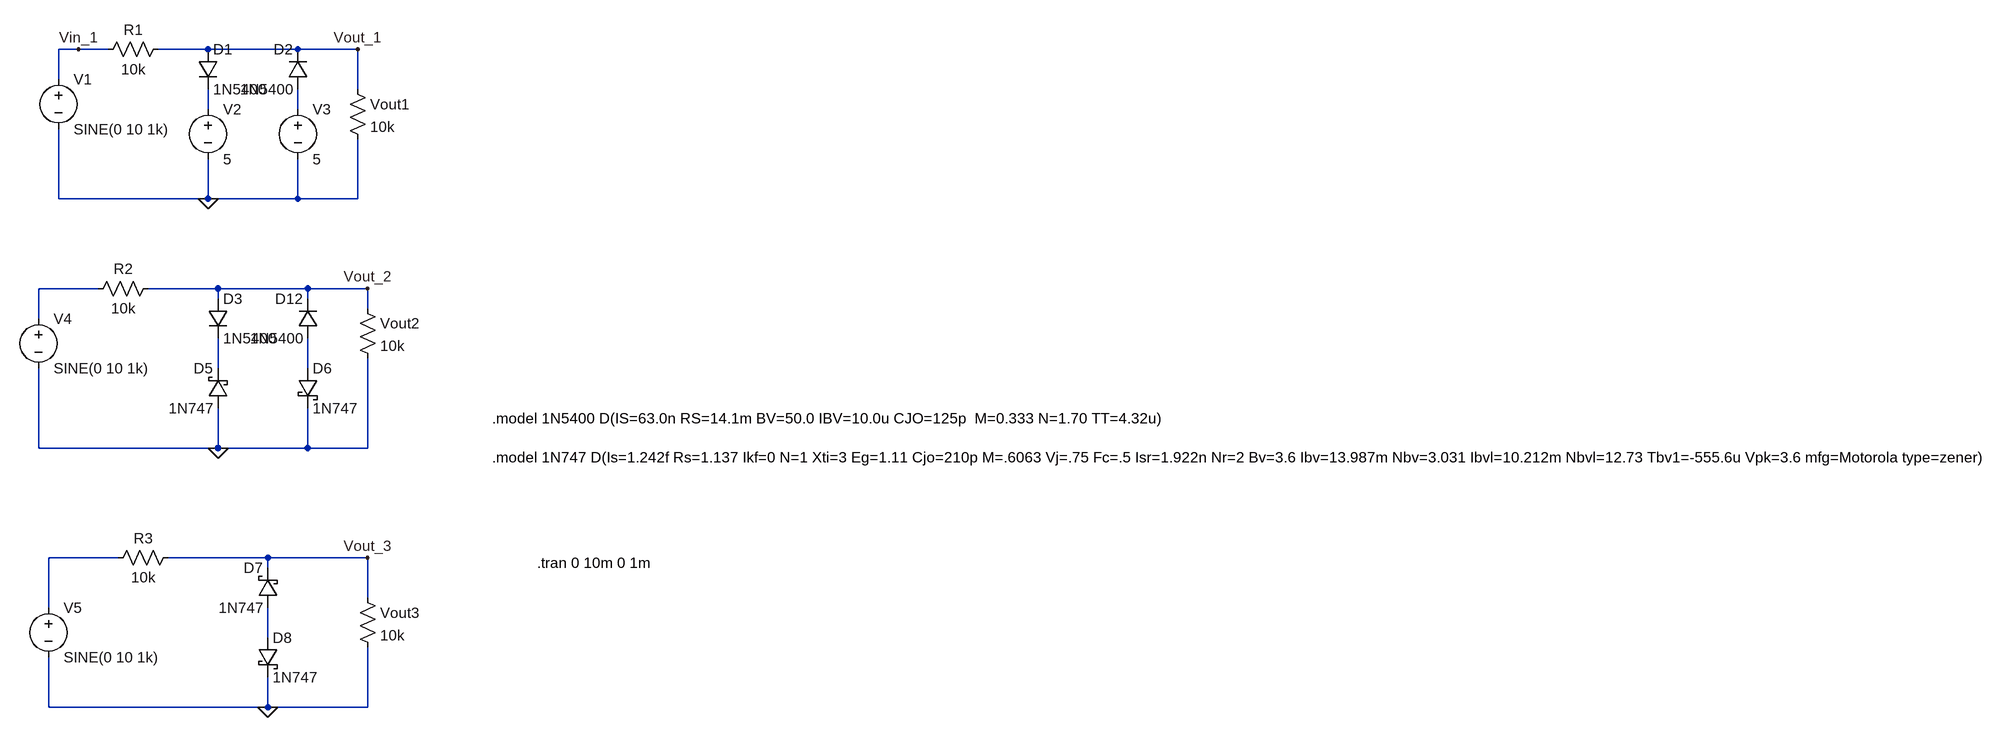
[diagram p0: schematic Lab3_2.asc]
Lab3_2.asc, the LTspice schematic file:
Version 4
SHEET 1 3268 1156
WIRE -48 80 -80 80
WIRE 0 80 -48 80
WIRE 160 80 80 80
WIRE 304 80 160 80
WIRE 400 80 304 80
WIRE -80 128 -80 80
WIRE 400 144 400 80
WIRE 160 176 160 144
WIRE 304 176 304 144
WIRE -80 320 -80 208
WIRE 160 320 160 256
WIRE 160 320 -80 320
WIRE 304 320 304 256
WIRE 304 320 160 320
WIRE 400 320 400 224
WIRE 400 320 304 320
WIRE -16 464 -112 464
WIRE 176 464 64 464
WIRE 320 464 176 464
WIRE 416 464 320 464
WIRE 176 480 176 464
WIRE 320 480 320 464
WIRE 416 496 416 464
WIRE -112 512 -112 464
WIRE 176 592 176 544
WIRE 320 592 320 544
WIRE -112 720 -112 592
WIRE 176 720 176 656
WIRE 176 720 -112 720
WIRE 320 720 320 656
WIRE 320 720 176 720
WIRE 416 720 416 576
WIRE 416 720 320 720
WIRE 16 896 -96 896
WIRE 256 896 96 896
WIRE 416 896 256 896
WIRE 256 912 256 896
WIRE 416 960 416 896
WIRE -96 976 -96 896
WIRE 256 1024 256 976
WIRE -96 1136 -96 1056
WIRE 256 1136 256 1088
WIRE 256 1136 -96 1136
WIRE 416 1136 416 1040
WIRE 416 1136 256 1136
FLAG 160 320 0
FLAG 176 720 0
FLAG 256 1136 0
FLAG -48 80 Vin_1
FLAG 400 80 Vout_1
FLAG 416 464 Vout_2
FLAG 416 896 Vout_3
SYMBOL voltage -80 112 R0
WINDOW 123 0 0 Left 0
WINDOW 39 0 0 Left 0
SYMATTR InstName V1
SYMATTR Value SINE(0 10 1k)
SYMBOL res 96 64 R90
WINDOW 0 0 56 VBottom 2
WINDOW 3 32 56 VTop 2
SYMATTR InstName R1
SYMATTR Value 10k
SYMBOL diode 144 80 R0
SYMATTR InstName D1
SYMATTR Value 1N5400
SYMBOL voltage 160 160 R0
WINDOW 123 0 0 Left 0
WINDOW 39 0 0 Left 0
SYMATTR InstName V2
SYMATTR Value 5
SYMBOL voltage 304 160 R0
WINDOW 123 0 0 Left 0
WINDOW 39 0 0 Left 0
SYMATTR InstName V3
SYMATTR Value 5
SYMBOL diode 320 144 R180
WINDOW 0 24 64 Left 2
WINDOW 3 24 0 Left 2
SYMATTR InstName D2
SYMATTR Value 1N5400
SYMBOL res 384 128 R0
SYMATTR InstName Vout1
SYMATTR Value 10k
SYMBOL res -32 480 R270
WINDOW 0 32 56 VTop 2
WINDOW 3 0 56 VBottom 2
SYMATTR InstName R2
SYMATTR Value 10k
SYMBOL diode 160 480 R0
SYMATTR InstName D3
SYMATTR Value 1N5400
SYMBOL diode 336 544 R180
WINDOW 0 24 64 Left 2
WINDOW 3 24 0 Left 2
SYMATTR InstName D12
SYMATTR Value 1N5400
SYMBOL res 400 480 R0
SYMATTR InstName Vout2
SYMATTR Value 10k
SYMBOL voltage -112 496 R0
WINDOW 123 0 0 Left 0
WINDOW 39 0 0 Left 0
SYMATTR InstName V4
SYMATTR Value SINE(0 10 1k)
SYMBOL schottky 192 656 R180
WINDOW 0 24 64 Left 2
WINDOW 3 24 0 Left 2
SYMATTR InstName D5
SYMATTR Value 1N747
SYMATTR Description Diode
SYMATTR Type diode
SYMBOL schottky 304 592 R0
SYMATTR InstName D6
SYMATTR Value 1N747
SYMATTR Description Diode
SYMATTR Type diode
SYMBOL schottky 272 976 R180
WINDOW 0 24 64 Left 2
WINDOW 3 24 0 Left 2
SYMATTR InstName D7
SYMATTR Value 1N747
SYMATTR Description Diode
SYMATTR Type diode
SYMBOL schottky 240 1024 R0
SYMATTR InstName D8
SYMATTR Value 1N747
SYMATTR Description Diode
SYMATTR Type diode
SYMBOL res 112 880 R90
WINDOW 0 0 56 VBottom 2
WINDOW 3 32 56 VTop 2
SYMATTR InstName R3
SYMATTR Value 10k
SYMBOL voltage -96 960 R0
WINDOW 123 0 0 Left 0
WINDOW 39 0 0 Left 0
SYMATTR InstName V5
SYMATTR Value SINE(0 10 1k)
SYMBOL res 400 944 R0
SYMATTR InstName Vout3
SYMATTR Value 10k
TEXT 616 672 Left 2 !.model 1N5400 D(IS=63.0n RS=14.1m BV=50.0 IBV=10.0u CJO=125p  M=0.333 N=1.70 TT=4.32u)\n \n.model 1N747 D(Is=1.242f Rs=1.137 Ikf=0 N=1 Xti=3 Eg=1.11 Cjo=210p M=.6063 Vj=.75 Fc=.5 Isr=1.922n Nr=2 Bv=3.6 Ibv=13.987m Nbv=3.031 Ibvl=10.212m Nbvl=12.73 Tbv1=-555.6u Vpk=3.6 mfg=Motorola type=zener)
TEXT 688 904 Left 2 !.tran 0 10m 0 1m

The netlist it stands for:
* Lab3_2.asc
V1 Vin_1 0 SINE(0 10 1k)
R1 Vout_1 Vin_1 10k
D1 Vout_1 N001 1N5400
V2 N001 0 5
V3 N002 0 5
D2 N002 Vout_1 1N5400
R§Vout1 Vout_1 0 10k
R2 N003 Vout_2 10k
D3 Vout_2 N004 1N5400
D12 N005 Vout_2 1N5400
R§Vout2 Vout_2 0 10k
V4 N003 0 SINE(0 10 1k)
D5 0 N004 1N747
D6 N005 0 1N747
D7 N007 Vout_3 1N747
D8 N007 0 1N747
R3 Vout_3 N006 10k
V5 N006 0 SINE(0 10 1k)
R§Vout3 Vout_3 0 10k
.model D D
.lib standard.dio
.model 1N5400 D(IS=63.0n RS=14.1m BV=50.0 IBV=10.0u CJO=125p  M=0.333 N=1.70 TT=4.32u)
.model 1N747 D(Is=1.242f Rs=1.137 Ikf=0 N=1 Xti=3 Eg=1.11 Cjo=210p M=.6063 Vj=.75 Fc=.5 Isr=1.922n Nr=2 Bv=3.6 Ibv=13.987m Nbv=3.031 Ibvl=10.212m Nbvl=12.73 Tbv1=-555.6u Vpk=3.6 mfg=Motorola type=zener)
.tran 0 10m 0 1m
.backanno
.end